# EAGLE design Wireless button (EAGLE 9.1.0)
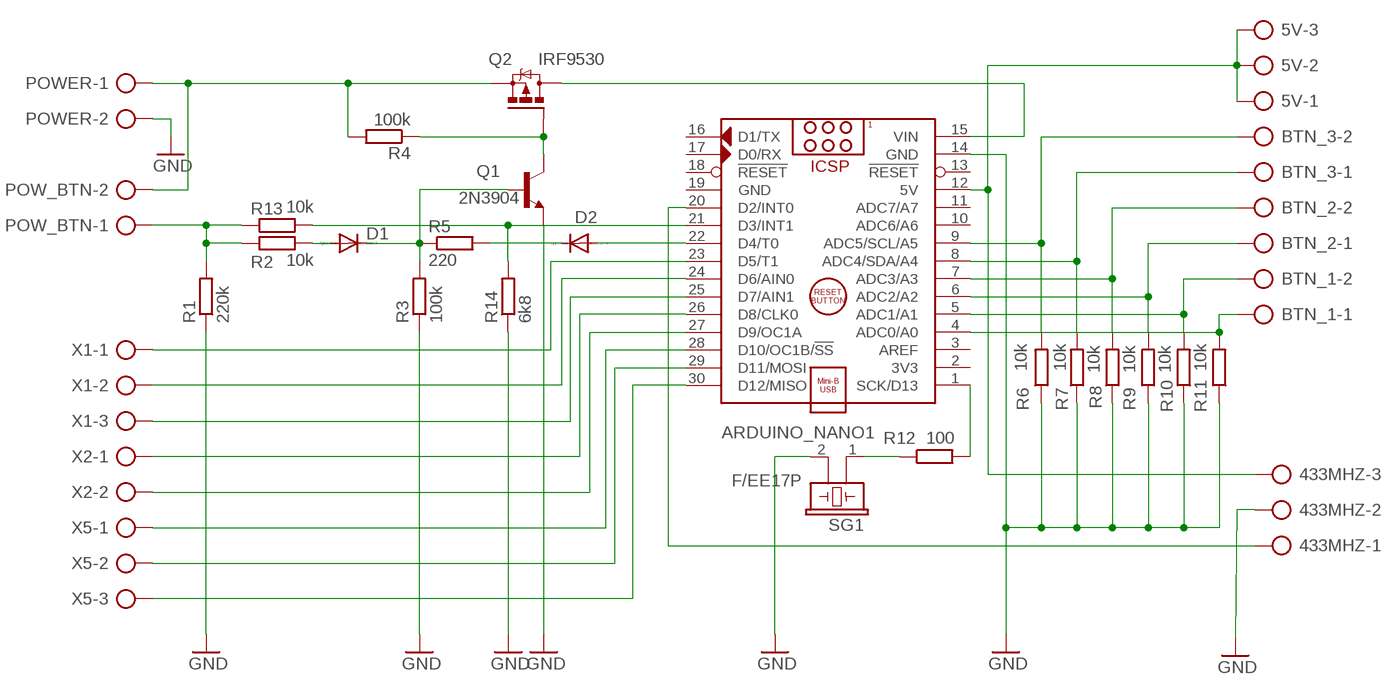
[diagram p0: schematic, sheet 1]

## Parts
5V  AK500/3  [AK500/3]
433MHZ  AK500/3  [AK500/3]
ARDUINO_NANO1  ARDUINO_NANO  [ARDUINO_NANO]
BTN_1  AK500/2  [AK500/2]
BTN_2  AK500/2  [AK500/2]
BTN_3  AK500/2  [AK500/2]
D1  1N4148DO35-7  [DO35-7]
D2  1N4148DO35-7  [DO35-7]
POW_BTN  AK500/2  [AK500/2]
POWER  AK500/2  [AK500/2]
Q1  2N3904  [TO92]
Q2  IRF9530  [TO220BV]
R1  220k  R-EU_0207/7  [0207/7]
R2  10k  R-EU_0207/7  [0207/7]
R3  100k  R-EU_0207/7  [0207/7]
R4  100k  R-EU_0207/7  [0207/7]
R5  220  R-EU_0207/7  [0207/7]
R6  10k  R-EU_0207/7  [0207/7]
R7  10k  R-EU_0207/7  [0207/7]
R8  10k  R-EU_0207/7  [0207/7]
R9  10k  R-EU_0207/7  [0207/7]
R10  10k  R-EU_0207/7  [0207/7]
R11  10k  R-EU_0207/7  [0207/7]
R12  100  R-EU_0207/7  [0207/7]
R13  10k  R-EU_0207/7  [0207/7]
R14  6k8  R-EU_0207/7  [0207/7]
SG1  F/EE17P  [F/EE17P]
X1  AK500/3  [AK500/3]
X2  AK500/2  [AK500/2]
X5  AK500/3  [AK500/3]

## Nets
5V: 5V.1 5V.2 5V.3 433MHZ.3 ARDUINO_NANO1.12(5V)
AWAY_DOWN: ARDUINO_NANO1.5(ADC1/A1) BTN_1.2 R10.2
AWAY_UP: ARDUINO_NANO1.4(ADC0/A0) BTN_1.1 R11.2
BUZZ: ARDUINO_NANO1.1(SCK/D13) R12.2
GND: 433MHZ.2 ARDUINO_NANO1.14(GND) POWER.2 Q1.3(E) R1.1 R3.1 R6.1 R7.1 R8.1 R9.1 R10.1 R11.1 R14.1 SG1.2
HOME_DOWN: ARDUINO_NANO1.7(ADC3/A3) BTN_2.2 R8.2
HOME_UP: ARDUINO_NANO1.6(ADC2/A2) BTN_2.1 R9.2
N$1: ARDUINO_NANO1.22(D4/T0) D2.A
N$2: Q1.1(C) Q2.G R4.1
N$3: ARDUINO_NANO1.23(D5/T1) X1.1
N$4: D1.A R2.2
N$5: D1.C Q1.2(B) R3.2 R5.1
N$6: D2.C R5.2
N$7: ARDUINO_NANO1.24(D6/AIN0) X1.2
N$8: ARDUINO_NANO1.25(D7/AIN1) X1.3
N$9: R12.1 SG1.1
N$10: 433MHZ.1 ARDUINO_NANO1.20(D2/INT0)
N$15: ARDUINO_NANO1.26(D8/CLK0) X2.1
N$17: ARDUINO_NANO1.27(D9/OC1A) X2.2
N$18: ARDUINO_NANO1.28(D10/OC1B/!SS) X5.1
N$19: ARDUINO_NANO1.29(D11/MOSI) X5.2
N$20: ARDUINO_NANO1.30(D12/MISO) X5.3
N$22: ARDUINO_NANO1.21(D3/INT1) R13.2 R14.2
OFF: POW_BTN.1 R1.2 R2.1 R13.1
POWER: POW_BTN.2 POWER.1 Q2.S R4.2
RESET: ARDUINO_NANO1.9(ADC5/SCL/A5) BTN_3.2 R6.2
SWAP: ARDUINO_NANO1.8(ADC4/SDA/A4) BTN_3.1 R7.2
VCC: ARDUINO_NANO1.15(VIN) Q2.D
Unconnected: ARDUINO_NANO1.2(3V3) ARDUINO_NANO1.3(AREF) ARDUINO_NANO1.10(ADC6/A6) ARDUINO_NANO1.11(ADC7/A7) ARDUINO_NANO1.13(!RESET) ARDUINO_NANO1.16(D1/TX) ARDUINO_NANO1.17(D0/RX) ARDUINO_NANO1.18(!RESET)

## Power pins joined to a net without a drawn wire
GND: ARDUINO_NANO1.19(GND)

## Library data of the parts
5V 433MHZ X1 X5 = con-ptr500:AK500/3: CONNECTOR; OC_FARNELL: unknown; OC_NEWARK: unknown
ARDUINO_NANO1 = ArduinoNanoV30:ARDUINO_NANO: Arduino Nano V3.0 Module Overview: The Arduino Nano is a small, complete, and breadboard-friendly board based on the ATmega328 (Arduino Nano 3.x) or ATmega168 (Arduino Nano 2.x). It has more or less the same functionality of the Arduino Duemilanove, but in a different package. It lacks only a DC power jack, and works with a Mini-B USB cable instead of a standard one. The Nano was designed and is being produced by Gravitech <http://www.gravitech.us/arna30wiatp.html>. General specifications: Item Value Microcontroller Atmel ATmega168 or ATmega328 Operating Voltage (logic level) 5 V Input Voltage (recommended) 7-12 V Input Voltage (limits) 6-20 V Digital I/O Pins 14 (of which 6 provide PWM output) Analog Input Pins 8 DC Current per I/O Pin 40 mA Flash Memory 16 KB (ATmega168) or 32 KB (ATmega328) of which 2 KB used by bootloader SRAM 1 KB (ATmega168) or 2 KB (ATmega328) EEPROM 512 bytes (ATmega168) or 1 KB (ATmega328) Clock Speed 16 MHz Dimensions (Inches) 0.73" x 1.70" Dimensions (mm) 18mm x 45mm Overall height About 9 mm (not including pins) Weigth 5 g Power: The Arduino Nano can be powered via the Mini-B USB connection, 6-20V unregulated external power supply (pin 30), or 5V regulated external power supply (pin 27). The power source is automatically selected to the highest voltage source. Memory: The ATmega168 has 16 KB of flash memory for storing code (of which 2 KB is used for the bootloader); the ATmega328 has 32 KB, (also with 2 KB used for the bootloader). The ATmega168 has 1 KB of SRAM and 512 bytes of EEPROM (which can be read and written with the EEPROM library); the ATmega328 has 2 KB of SRAM and 1 KB of EEPROM. Input and Output: Each of the 14 digital pins on the Nano can be used as an input or output, using pinMode(), digitalWrite(), and digitalRead() functions. They operate at 5 volts. Each pin can provide or receive a maximum of 40 mA and has an internal pull-up resistor (disconnected by default) of 20-50 kOhms. In addition, some pins have specialized functions. Visit Arduino - ArduinoBoardNano <https://www.arduino.cc/en/Main/ArduinoBoardNano>
BTN_1-BTN_3 POW_BTN POWER X2 = con-ptr500:AK500/2: CONNECTOR; OC_FARNELL: unknown; OC_NEWARK: unknown
D1 D2 = diode:1N4148: DIODE high speed (Philips)
Q1 = transistor-npn:2N3904: NPN Transistor
Q2 = transistor-power:IRF9530: P-CHANNEL HEXFET POWER-MOS-FET Source: http://www.irf.com/product-info/datasheets/data/irf9530.pdf
R1-R14 = resistor:R-EU_: RESISTOR, European symbol
SG1 = buzzer:F/EE17P: BUZZER Source: Buerklin; OC_FARNELL: unknown; OC_NEWARK: unknown

## Board
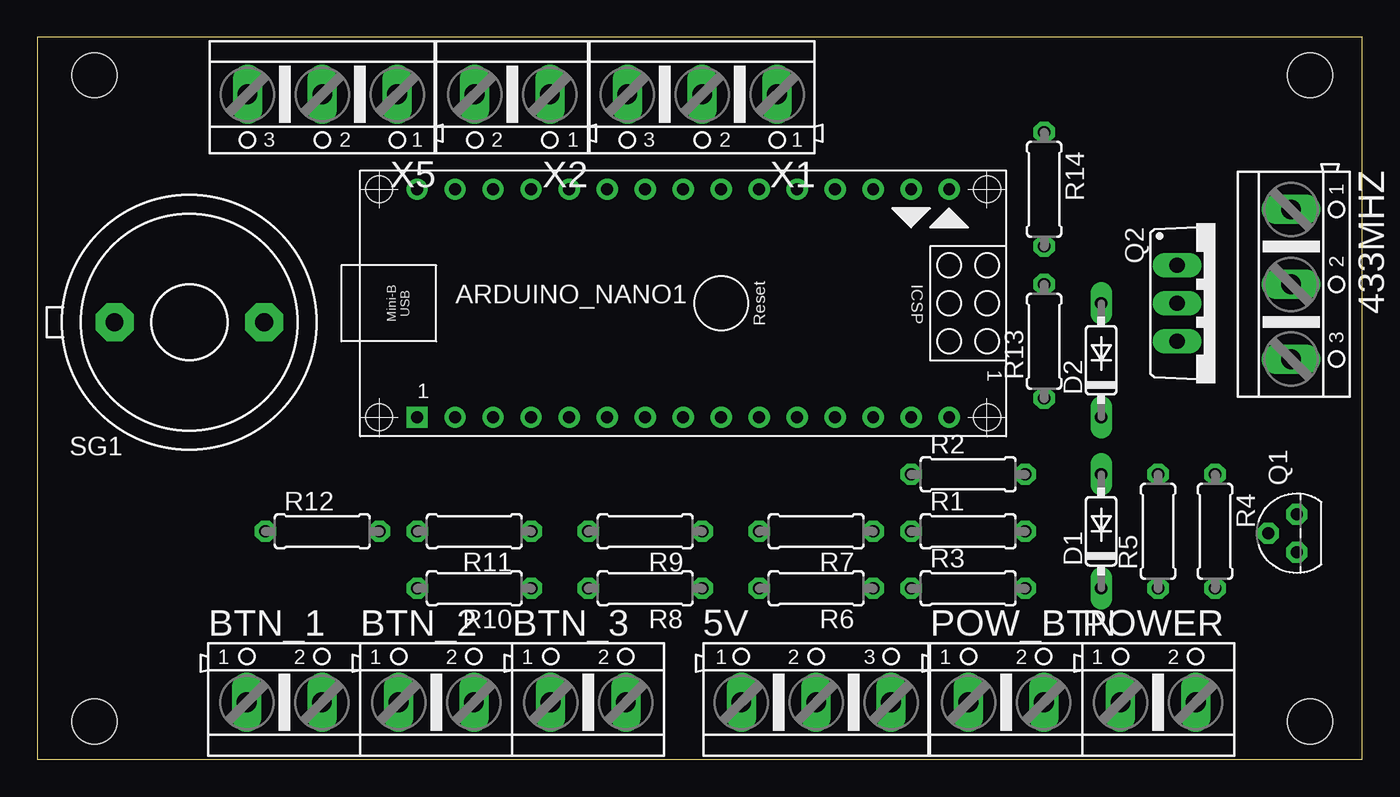
[diagram p1: board, top side]
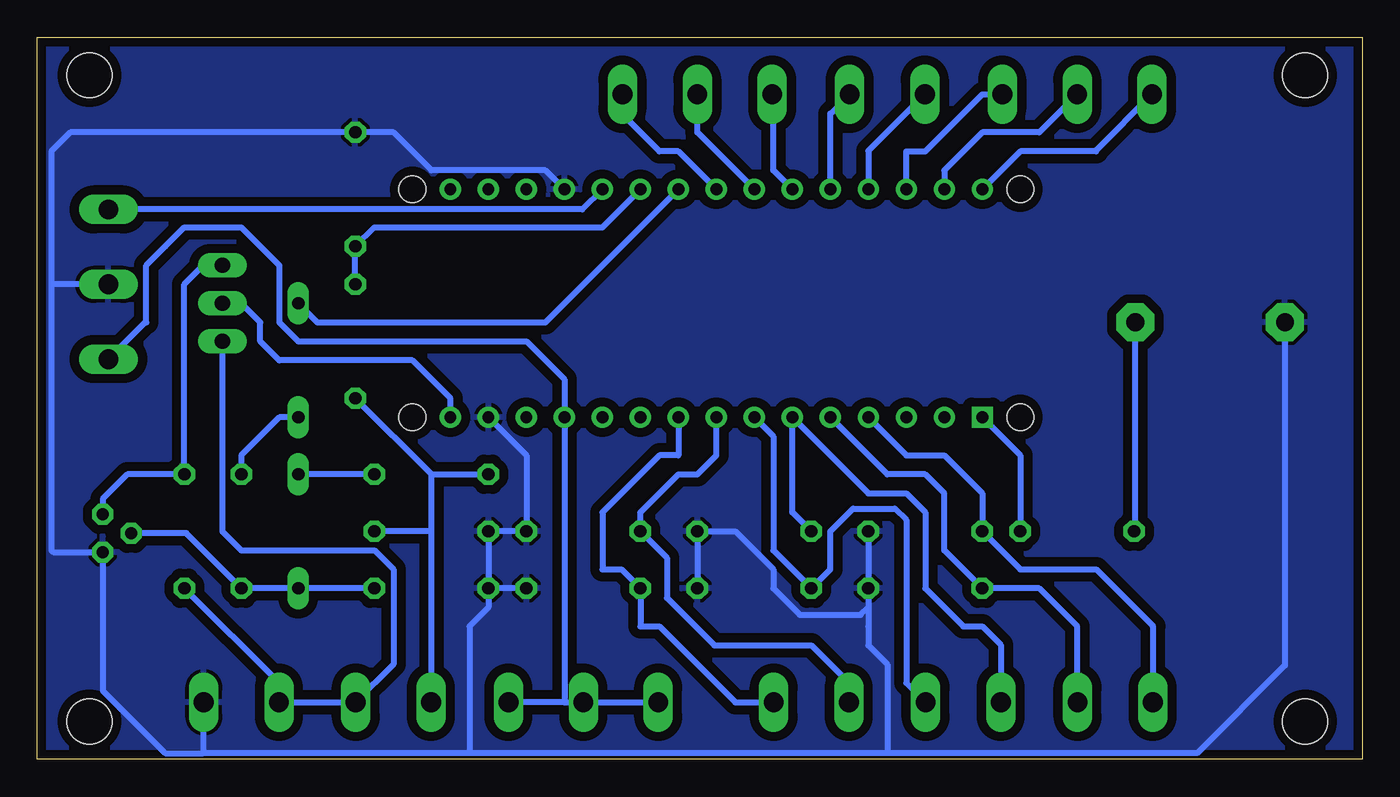
[diagram p2: board, bottom side, seen from below]

Size 88.57 x 48.25 mm. Coordinates in mm from the lower left corner, seen from the top.
Outline: 0,0 88.57,0 88.57,48.25 0,48.25 0,0
Copper layers (1*16): Top 0.035mm / dielectric 1.5mm / Bottom 0.035mm
Design rules "SparkFun": minimum track width 8mil, minimum drill 20mil, track to track 8mil, track to pad 8mil, pad to pad 8mil, via to via 8mil, smd to smd 8mil, copper to edge 8mil, drill to drill 8mil, minimum pad ring 12mil, minimum via ring 10mil, stop-mask expansion 4mil, vias tented up to drill 20mil, thermal gap 10mil
Holes 3 mm at 3.81,2.54 3.81,45.72 85.09,45.72 85.09,2.54

### Footprints (pad centres in the part's own frame; a part is rotated, then mirrored left to right if it is on the bottom)
AK500/3 = drill 1.321 long: 1 -5.004,0; 2 0,0; 3 5.004,0
ARDUINO_NANO = drill 0.8 square: 1 -20.32,-7.62 | drill 0.8: 2 -17.78,-7.62; 3 -15.24,-7.62; 4 -12.7,-7.62; 5 -10.16,-7.62; 6 -7.62,-7.62; 7 -5.08,-7.62; 8 -2.54,-7.62; 9 0,-7.62; 10 2.54,-7.62; 11 5.08,-7.62; 12 7.62,-7.62; 13 10.16,-7.62; 14 12.7,-7.62; 15 15.24,-7.62; 16 15.24,7.62; 17 12.7,7.62; 18 10.16,7.62; 19 7.62,7.62; 20 5.08,7.62; 21 2.54,7.62; 22 0,7.62; 23 -2.54,7.62; 24 -5.08,7.62; 25 -7.62,7.62; 26 -10.16,7.62; 27 -12.7,7.62; 28 -15.24,7.62; 29 -17.78,7.62; 30 -20.32,7.62 | hole 1.778: -22.86,-7.62; -22.86,7.62; 17.78,7.62; 17.78,-7.62
AK500/2 = drill 1.321 long: 1 -2.515,0; 2 2.515,0
DO35-7 = drill 0.813 long: A 3.81,0; C -3.81,0
TO92 = drill 0.813 octagon: 1 1.27,0; 2 0,1.905; 3 -1.27,0
TO220BV = drill 1.016 long: D 0,-2.54; G -2.54,-2.54; S 2.54,-2.54
0207/7 = drill 0.813 octagon: 1 -3.81,0; 2 3.81,0
F/EE17P = drill 1.194 pad 2.54 octagon: 1 -5.004,0; 2 5.004,0

### Placement (x,y rotation side)
5V  52.07,3.81 0 top
433MHZ  83.82,31.75 270 top
ARDUINO_NANO1  45.72,30.48 0 top
BTN_1  16.51,3.81 0 top
BTN_2  26.67,3.81 0 top
BTN_3  36.83,3.81 0 top
D1  71.12,15.24 90 top
D2  71.12,26.67 90 top
POW_BTN  64.77,3.81 0 top
POWER  74.93,3.81 0 top
Q1  84.2,15.11 90 top
Q2  78.74,30.48 270 top
R1  62.23,15.24 0 top
R2  62.23,19.05 0 top
R3  62.23,11.43 0 top
R4  78.74,15.24 270 top
R5  74.93,15.24 90 top
R6  52.07,11.43 180 top
R7  52.07,15.24 180 top
R8  40.64,11.43 180 top
R9  40.64,15.24 180 top
R10  29.21,11.43 180 top
R11  29.21,15.24 180 top
R12  19.05,15.24 0 top
R13  67.31,27.94 90 top
R14  67.31,38.1 270 top
SG1  10.16,29.21 180 top
X1  44.45,44.45 180 top
X2  31.75,44.45 180 top
X5  19.05,44.45 180 top

### Tracks (layer width: path | path; a pad name or v marks a point on that pad's centre or on a via)
5V
  Bottom 0.406: 53.34,3.81 ARDUINO_NANO1.12 53.34,25.4 55.88,27.94 71.12,27.94 72.39,29.21 72.39,33.02 74.93,35.56 78.74,35.56 80.01,34.29 81.28,33.02 81.28,29.21 81.36,29.21 433MHZ.3 | 53.34,3.81 5V.2 5V.1 | 53.34,3.81 5V.3
AWAY_DOWN
  Bottom 0.406: BTN_1.2 19.05,3.83 19.05,8.89 21.59,11.43 R10.2 27.94,13.97 27.94,17.78 29.21,19.05 31.75,19.05 ARDUINO_NANO1.5
AWAY_UP
  Bottom 0.406: ARDUINO_NANO1.4 30.48,20.32 27.94,20.32 25.4,17.78 R11.2 22.86,12.7 20.32,12.7 17.78,12.7 13.97,8.89 13.99,8.87 BTN_1.1
BUZZ
  Bottom 0.406: ARDUINO_NANO1.1 22.86,20.32 R12.2
GND
  Bottom 0.406: R3.1 R1.1 R7.1 55.88,20.32 ARDUINO_NANO1.14 | R3.1 58.42,10.16 59.69,8.89 59.69,0.41 | 59.69,0.41 77.47,0.41 | 77.47,0.41 77.44,0.43 | 77.44,0.43 POWER.2 | 59.69,0.41 44.45,0.41 31.75,0.41 | R11.1 R10.1 33.02,10.16 | 33.02,10.16 33.02,8.89 33.02,7.62 31.75,6.35 31.75,0.41 | SG1.2 5.16,6.27 11.02,0.41 31.75,0.41 | ARDUINO_NANO1.19 54.61,39.37 62.23,39.37 64.77,41.91 R14.1 86.36,41.91 87.63,40.64 87.63,31.75 | 87.63,31.75 87.63,13.97 87.5,13.84 Q1.3 84.2,4.6 80.01,0.41 77.47,0.41 | 77.47,0.41 77.44,0.43 | 433MHZ.2 87.63,31.75 | R6.1 R3.1 | 33.02,10.16 33.53,9.65 37.59,9.65 39.37,11.43 39.37,12.7 41.91,15.24 R9.1 R8.1
  pour Bottom (isolate 0.61): -1.27,0 -1.27,48.26 90.17,48.26 90.17,0
HOME_DOWN
  Bottom 0.406: ARDUINO_NANO1.7 39.37,21.59 39.37,13.97 R8.2 35.56,12.7 35.56,15.24 34.04,16.76 31.24,16.76 30.48,16 30.48,5.11 BTN_2.2
HOME_UP
  Bottom 0.406: BTN_2.1 24.16,7.64 25.4,8.89 26.67,8.89 29.21,11.43 29.21,16.51 30.48,17.78 33.02,17.78 ARDUINO_NANO1.6 38.1,16.51 R9.2
N$1
  Bottom 0.406: D2.A 69.85,29.21 54.61,29.21 ARDUINO_NANO1.22
N$2
  Bottom 0.406: Q1.1 84.2,17.4 82.55,19.05 R4.1 78.74,31.75 77.47,33.02 Q2.G
N$3
  Bottom 0.406: ARDUINO_NANO1.23 45.72,40.64 46.99,40.64 49.53,43.18 49.45,43.26 X1.1
N$4
  Bottom 0.406: R2.2 D1.A
N$5
  Bottom 0.406: R3.2 D1.C R5.1 78.61,15.11 Q1.2
N$6
  Bottom 0.406: D2.C 72.39,22.86 74.93,20.32 R5.2
N$7
  Bottom 0.406: ARDUINO_NANO1.24 44.45,41.91 X1.2
N$8
  Bottom 0.406: ARDUINO_NANO1.25 39.37,39.37 39.37,44.37 X1.3
N$9
  Bottom 0.406: R12.1 15.16,15.32 SG1.1
N$10
  Bottom 0.406: 433MHZ.1 52.15,36.75 ARDUINO_NANO1.20
N$15
  Bottom 0.406: X2.1 35.56,43.16 ARDUINO_NANO1.26
N$17
  Bottom 0.406: X2.2 33.02,40.66 ARDUINO_NANO1.27
N$18
  Bottom 0.406: ARDUINO_NANO1.28 30.48,40.64 29.21,40.64 25.4,44.45 X5.1
N$19
  Bottom 0.406: X5.2 21.59,41.91 25.4,41.91 27.94,39.37 ARDUINO_NANO1.29
N$20
  Bottom 0.406: X5.3 17.78,40.72 17.78,40.64 22.86,40.64 ARDUINO_NANO1.30
N$22
  Bottom 0.406: R13.2 R14.2 66.04,35.56 50.8,35.56 ARDUINO_NANO1.21
OFF
  Bottom 0.406: POW_BTN.1 62.23,3.83 62.23,15.24 | 62.23,15.24 62.23,19.05 | 62.23,19.05 R2.1 | 62.23,15.24 R1.2 | 62.23,19.05 R13.1
POWER
  Bottom 0.406: R4.2 72.42,5.11 POWER.1 67.31,3.81 | 67.31,3.81 POW_BTN.2 | Q2.S 76.2,15.24 74.93,13.97 66.04,13.97 64.77,12.7 64.77,6.35 67.31,3.81
RESET
  Bottom 0.406: BTN_3.2 41.91,3.81 46.99,8.89 48.26,8.89 R6.2 49.53,12.7 50.8,12.7 50.8,16.51 46.99,20.32 45.72,20.32 ARDUINO_NANO1.9
SWAP
  Bottom 0.406: BTN_3.1 34.31,5.05 34.29,5.08 36.83,7.62 43.31,7.62 46.48,10.79 46.48,13.46 R7.2 48.26,16.51 45.72,19.05 44.45,19.05 43.18,20.32 ARDUINO_NANO1.8
VCC
  Bottom 0.406: ARDUINO_NANO1.15 60.96,24.13 63.5,26.67 72.39,26.67 73.66,27.94 73.66,29.21 74.93,30.48 Q2.D